# EAGLE design pressure-humidity-main (EAGLE 6.0)
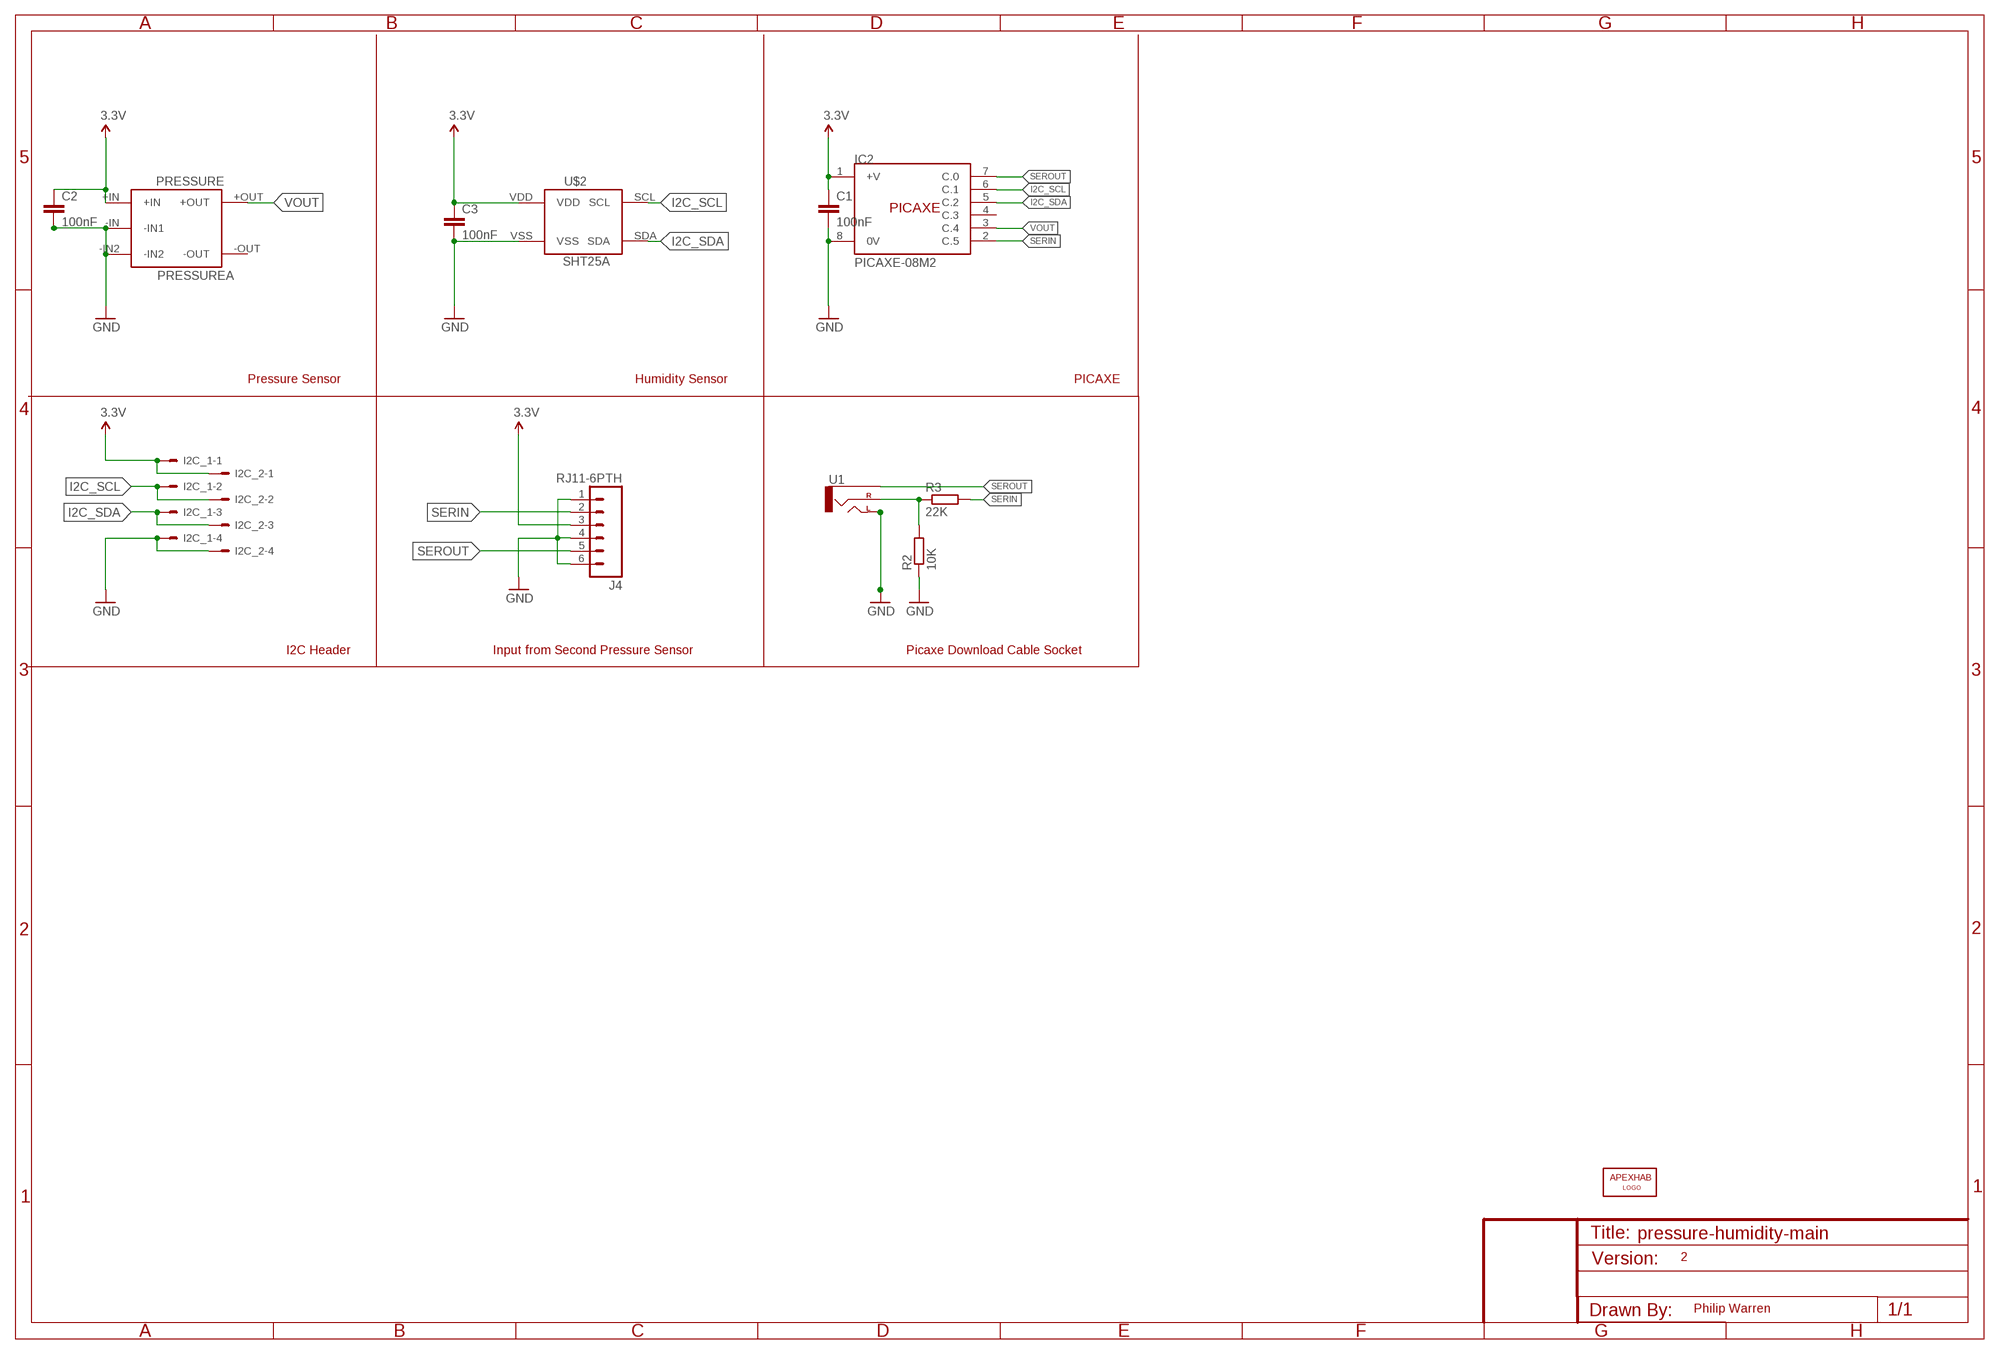
[diagram p0: schematic, sheet 1]

## Parts
C1  100nF  CAP0805  [0805]
C2  100nF  CAP0805  [0805]
C3  100nF  CAP0805  [0805]
I2C_1  22-27-2041-04  [6410-04]
I2C_2  22-27-2041-04  [6410-04]
IC2  PICAXE-08M2  [SOIC8]
J4  RJ11-6PTH  [RJ11-6]
JP1  APEXHAB-LOGO_APEXHAB-SMALL  [APEXHAB-LOGO-SMALL]
PRESSURE  PRESSUREA  [PRESSURE]
R2  10K  R-EU_R0805  [R0805]
R3  22K  R-EU_R0805  [R0805]
U1  AUDIO-JACKPTH  [AUDIO-JACK]
U$2  SHT25A  [SHT25]

## Nets
3.3V: C1.1 C2.1 C3.1 I2C_1.1 I2C_2.1 IC2.1(+V) J4.3 PRESSURE.+IN U$2.VDD
GND: C1.2 C2.2 C3.2 I2C_1.4 I2C_2.4 IC2.8(0V) J4.1 J4.4 J4.6 PRESSURE.-IN2 PRESSURE.-IN(-IN1) R2.1 U1.TIP(LEFT) U$2.VSS
I2C_SCL: I2C_1.2 I2C_2.2 IC2.6(C.1) U$2.SCL
I2C_SDA: I2C_1.3 I2C_2.3 IC2.5(C.2) U$2.SDA
N$1: R2.2 R3.1 U1.RING(RIGHT)
SERIN: IC2.2(C.5) J4.2 R3.2
SEROUT: IC2.7(C.0) J4.5 U1.SLEEVE
VOUT: IC2.3(C.4) PRESSURE.+OUT
Unconnected: IC2.4(C.3) PRESSURE.-OUT

## Notes on the sheet
- Pressure Sensor | Humidity Sensor | PICAXE
- I2C Header | Input from Second Pressure Sensor | Picaxe Download Cable Socket
- 2
- Philip Warren

## Library data of the parts
C1-C3 = apex:CAP: Capacitor Standard 0603 ceramic capacitor, and 0.1" leaded capacitor.
I2C_1 I2C_2 = apex:22-?-04: CONNECTOR wire to board 2.54 mm (.1 inch) pitch header; OC_FARNELL: unknown; OC_NEWARK: unknown
IC2 = apex:PICAXE-08M2
J4 = apex:RJ11-6: RJ11 Jack Simple 6 pin RJ11 jack. Commonly found on CAT3 devices and Microchip programmers. SKU: PRT-00132
JP1 = apex:APEXHAB-LOGO: ApexHAB PCB Logo This is the standard ApexHAB PCB logo.
PRESSURE = mylibrary:PRESSURE: NPP-301 SMD http://uk.farnell.com/ge-sensing-novasensor/npp-301a-100at/pressure-sensor/dp/1433554?Ntt=1433554
R2 R3 = apex:R-EU_: RESISTOR, European symbol
U1 = SparkFun:AUDIO-JACK: 3.5mm Audio Jack Simple 3.5mm common PCB mount audio jack. SKU: PRT-08032
U$2 = mylibrary:SHT25

## Board
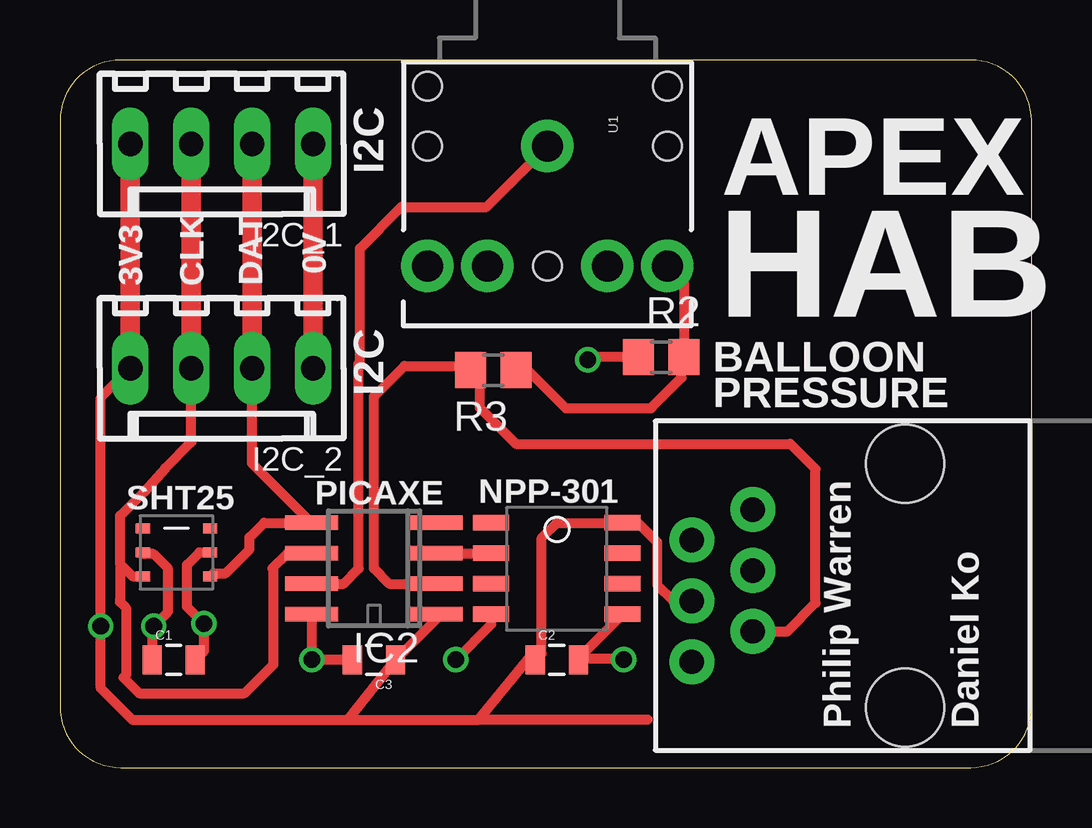
[diagram p1: board, top side]
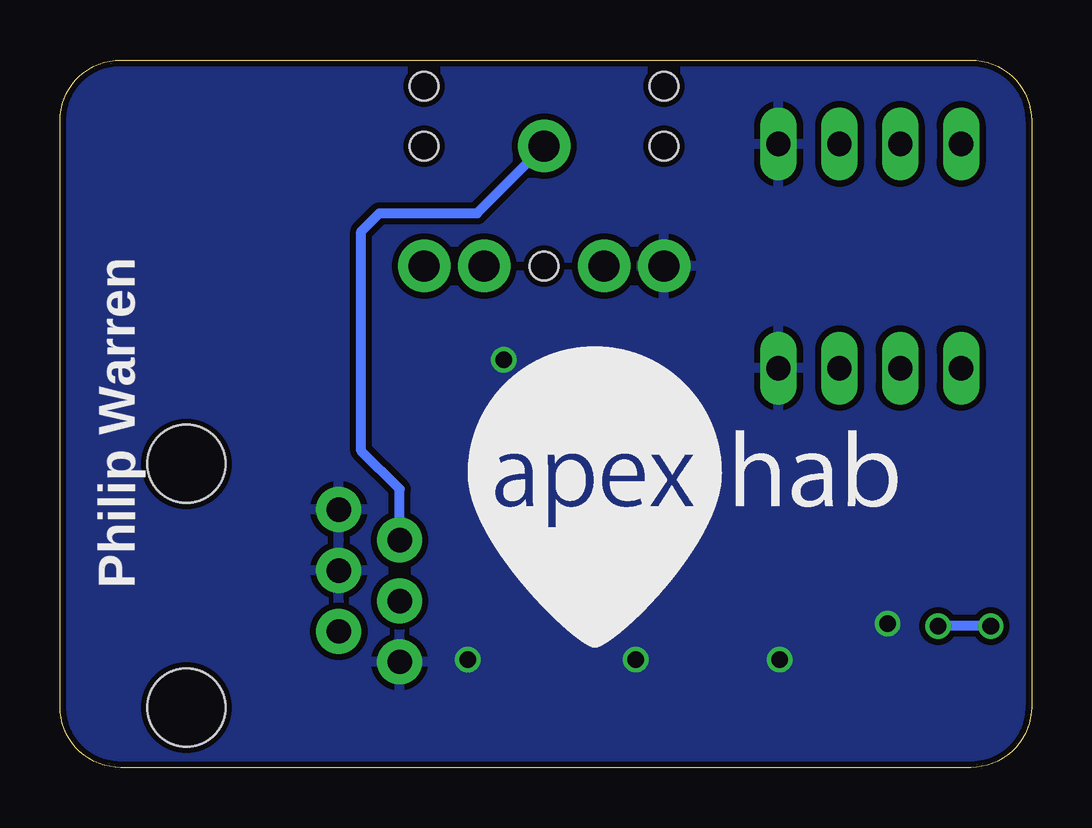
[diagram p2: board, bottom side, seen from below]

Size 40.5 x 29.5 mm. Coordinates in mm from the lower left corner, seen from the top.
Outline: 2.54,0 37.96,0 arc90 40.5,2.54 40.5,26.96 arc90 37.96,29.5 2.54,29.5 arc90 0,26.96 0,2.54 arc90 2.54,0
Copper layers (1*16): Top 0.035mm / dielectric 1.5mm / Bottom 0.035mm
Design rules: minimum track width 6mil, minimum drill 12mil, track to track 6mil, track to pad 6mil, pad to pad 6mil, via to via 6mil, smd to smd 0mil, copper to edge 10mil, drill to drill 10mil, minimum pad ring 10mil, minimum via ring 6mil, stop-mask expansion 2mil, vias tented up to drill 100mil, thermal gap 10mil

### Footprints (pad centres in the part's own frame; a part is rotated, then mirrored left to right if it is on the bottom)
0805 = smd 0.8 x 1.2: 1 -0.9,0; 2 0.9,0
6410-04 = drill 1.016 long: 1 3.81,0; 2 1.27,0; 3 -1.27,0; 4 -3.81,0
SOIC8 = smd 0.6 x 2.2: 1 -1.905,-2.6; 2 -0.635,-2.6; 3 0.635,-2.6; 4 1.905,-2.6; 5 1.905,2.6; 6 0.635,2.6; 7 -0.635,2.6; 8 -1.905,2.6
RJ11-6 = drill 1.016 pad 1.88: 1 1.905,8.89; 2 3.175,6.35; 3 4.445,8.89; 4 5.715,6.35; 5 6.985,8.89; 6 8.255,6.35 | hole 3.251: 0,0; 10.16,0
PRESSURE = smd 1.5 x 0.65: +IN 2.74,1.27; +OUT -2.74,0; -IN -2.74,-2.54; -IN2 2.74,-2.54; -OUT 2.74,-1.27; NC1 -2.74,1.27; NC2 -2.74,-1.27; NC3 2.74,0
R0805 = smd 1.3 x 1.5: 1 -0.95,0; 2 0.95,0
AUDIO-JACK = drill 1.3 pad 2.184: RING 5,5; RSH 5,2.5; SLEEVE 0,0; TIP 5,-5; TSH 5,-2.5 | hole 1.2: 0,5; -2.5,5; -2.5,-5; 0,-5; 5,0
SHT25 = smd 0.4 x 0.6: NC1 -1,1.4; NC2 -1,-1.4; SCL 1,-1.4; SDA 1,1.4; VDD 0,-1.4; VSS 0,1.4

### Placement (x,y rotation side)
C1  4.74,4.49 0 top
C2  20.71,4.49 0 top
C3  13.09,4.49 180 top
I2C_1  6.74,26 180 top
I2C_2  6.74,16.65 180 top
IC2  13.09,8.3 90 top
J4  35.23,2.5 90 top
JP1  23.5,5 0 bottom
PRESSURE  20.71,8.94 0 top
R2  25.06,17.11 0 top
R3  18.06,16.57 180 top
U1  20.32,25.91 270 top
U$2  4.86,8.97 270 top

### Tracks (layer width: path | path; a pad name or v marks a point on that pad's centre or on a via)
3.3V  (via drill 0.7)
  Top 0.406: U$2.VDD 3.53,8.9 3.9,8.9 4.5,8.3 4.5,6.5 v3.9,5.9 3.9,5.5 3.84,5.5 | 3.84,5.5 C1.1 | 3.84,5.5 3.84,5.84 | I2C_2.1 1.7,15.42 v1.7,5.9 1.7,3.3 3,2 12,2 | 12,2 C3.1 15.69,6.19 IC2.1 | 17.45,2 19.81,4.86 C2.1 20.07,4.75 20.07,9.57 20.71,10.21 PRESSURE.+IN 24.09,10.21 24.89,9.4 24.89,7.62 25.57,6.95 J4.3 | 12,2 17.45,2 | 24.5,2 17.45,2
  Top 0.813: I2C_2.1 I2C_1.1
  Bottom 0.406: v1.7,5.9 v3.9,5.9
GND  (via drill 0.7)
  Top 0.406: C2.2 21.61,4.55 | 21.61,4.55 PRESSURE.-IN2 | 5.5,4.63 5.55,4.63 C1.2 6,4.85 v6,6 5.3,6.7 5.3,8.45 5.82,8.97 U$2.VSS | C3.2 v10.51,4.49 v10.5,4.5 IC2.8 | 10.5,6.5 IC2.8 | IC2.8 | 21.61,4.55 23.45,4.55 v23.5,4.5 | PRESSURE.-IN 17.97,5.97 v16.5,4.5 | R2.1 22.11,17.11 v22,17
  Top 0.813: I2C_2.4 I2C_1.4
  pour Bottom (isolate 0.254): 0,29.5 0,0 40.5,0 40.5,29.5
I2C_SCL
  Top 0.406: IC2.6 9.48,8.94 8.85,8.3 8.9,8.24 8.9,4.3 7.7,3.1 3.3,3.1 2.65,3.75 2.75,3.85 2.75,6.65 2.5,6.9 2.5,7 2.5,8.5 | I2C_2.2 5.47,13.57 4.4,12.5 3.5,11.5 2.5,10.5 2.5,9.1 2.5,8.5 | U$2.SCL 3.03,7.97 2.5,8.5
  Top 0.813: I2C_2.2 I2C_1.2
I2C_SDA
  Top 0.406: I2C_2.3 8.01,12.69 IC2.5 8.51,10.21 7.9,9.6 7.9,9.1 6.9,8.1 6.39,8.1 U$2.SDA
  Top 0.813: I2C_2.3 I2C_1.3
N$1
  Top 0.406: U1.RING 26.01,20.22 R2.2 25.91,17.01 25.91,16.26 24.64,14.99 21.08,14.99 19.5,16.57 R3.1
SERIN
  Top 0.406: IC2.2 13.72,7.67 13.09,8.3 13.09,15.47 14.36,16.75 16.93,16.75 R3.2 17.5,16.18 17.5,15 19,13.5 30.44,13.5 31.5,12.45 31.5,6.86 30.31,5.67 J4.2
SEROUT
  Top 0.406: IC2.7 11.82,7.67 12.46,8.3 12.46,16.88 12.5,16.93 12.5,21.64 14.22,23.37 17.78,23.37 U1.SLEEVE
  Bottom 0.406: J4.5 26.34,11.61 27.94,13.21 27.94,22.35 27.18,23.11 23.11,23.11 U1.SLEEVE
VOUT
  Top 0.406: IC2.3 PRESSURE.+OUT

### Text on the board
tPlace: I2C | APEX | 0V | 3V3 | CLK | DAT | HAB | I2C | BALLOON | PRESSURE | SHT25 | PICAXE | NPP-301 | Philip Warren | Daniel Ko
bPlace: Philip Warren